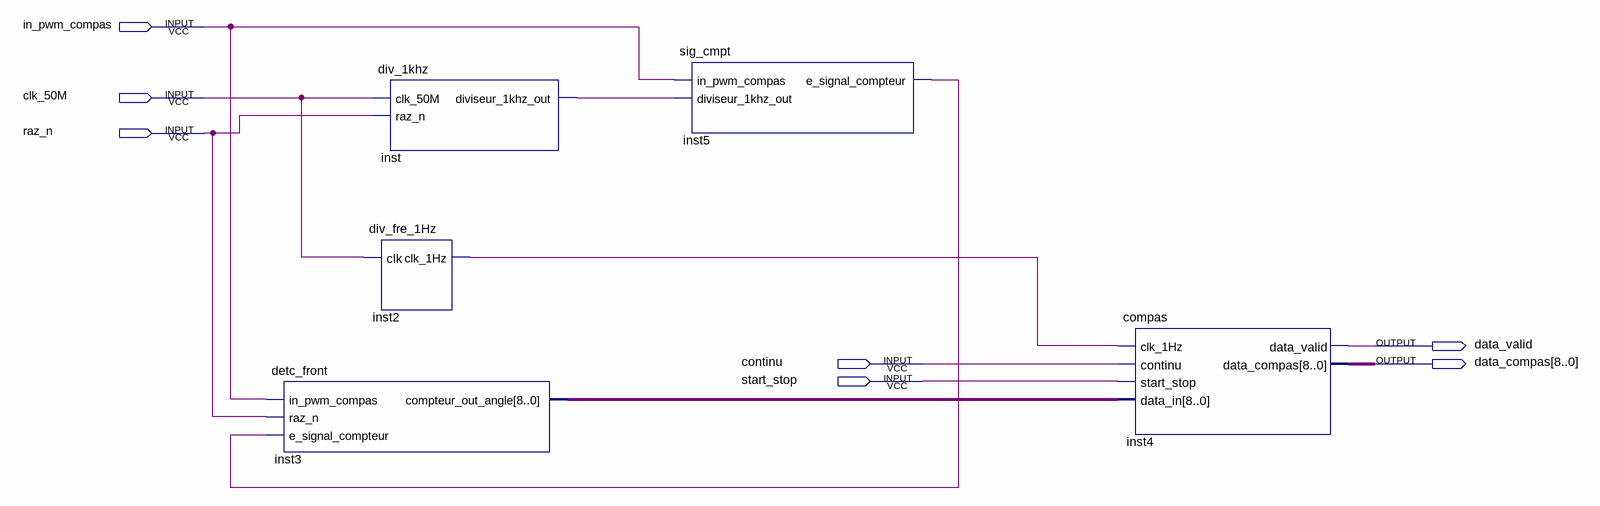
[diagram p0: schematic sheet]
// Quartus schematic cmp_9.bdf as structural Verilog: 5 symbols, 7 pins
module cmp_9 (
  input  in_pwm_compas,
  input  clk_50M,
  input  raz_n,
  input  continu,
  input  start_stop,
  output data_valid,
  output [8:0] data_compas
);

  wire inst2_clk_1hz, inst5_e_signal_compteur, inst_diviseur_1khz_out;
  wire [8:0] inst3_compteur_out_angle;

  detc_front inst3 (
    .in_pwm_compas(in_pwm_compas), .raz_n(raz_n), .e_signal_compteur(inst5_e_signal_compteur),
    .compteur_out_angle(inst3_compteur_out_angle));
  div_fre_1Hz inst2 (.clk(clk_50M), .clk_1Hz(inst2_clk_1hz));
  div_1khz inst (.clk_50M(clk_50M), .raz_n(raz_n), .diviseur_1khz_out(inst_diviseur_1khz_out));
  sig_cmpt inst5 (
    .in_pwm_compas(in_pwm_compas), .diviseur_1khz_out(inst_diviseur_1khz_out),
    .e_signal_compteur(inst5_e_signal_compteur));
  compas inst4 (
    .clk_1Hz(inst2_clk_1hz), .continu(continu), .start_stop(start_stop), .data_in(inst3_compteur_out_angle),
    .data_valid(data_valid), .data_compas(data_compas));
endmodule
